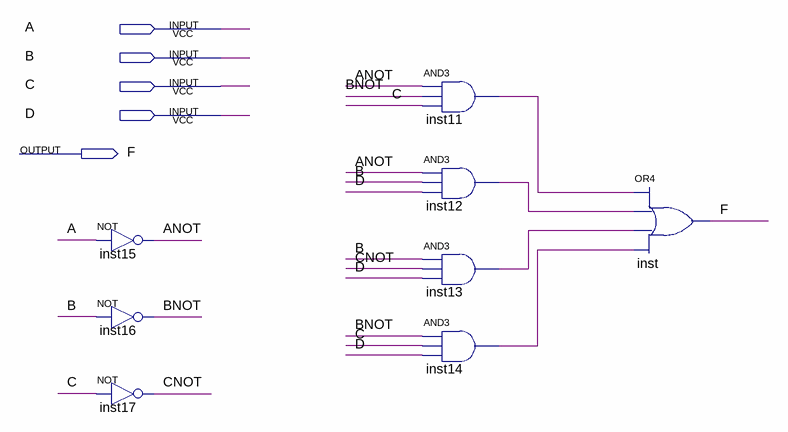
[diagram p0: schematic sheet]
// Quartus schematic Prime.bdf as structural Verilog: 8 symbols, 5 pins
module Prime (
  input  A,
  input  B,
  input  C,
  input  D,
  output F
);

  wire ANOT, BNOT, CNOT, inst11_out, inst12_out, inst13_out, inst14_out;

  not inst15 (ANOT, A);
  not inst16 (BNOT, B);
  not inst17 (CNOT, C);
  and inst11 (inst11_out, ANOT, BNOT, C);
  and inst12 (inst12_out, ANOT, B, D);
  and inst13 (inst13_out, B, CNOT, D);
  and inst14 (inst14_out, BNOT, C, D);
  or inst (F, inst11_out, inst12_out, inst13_out, inst14_out);
endmodule
